# Altium schematic sheet USBStereoAudioCodec.SchDoc
size A
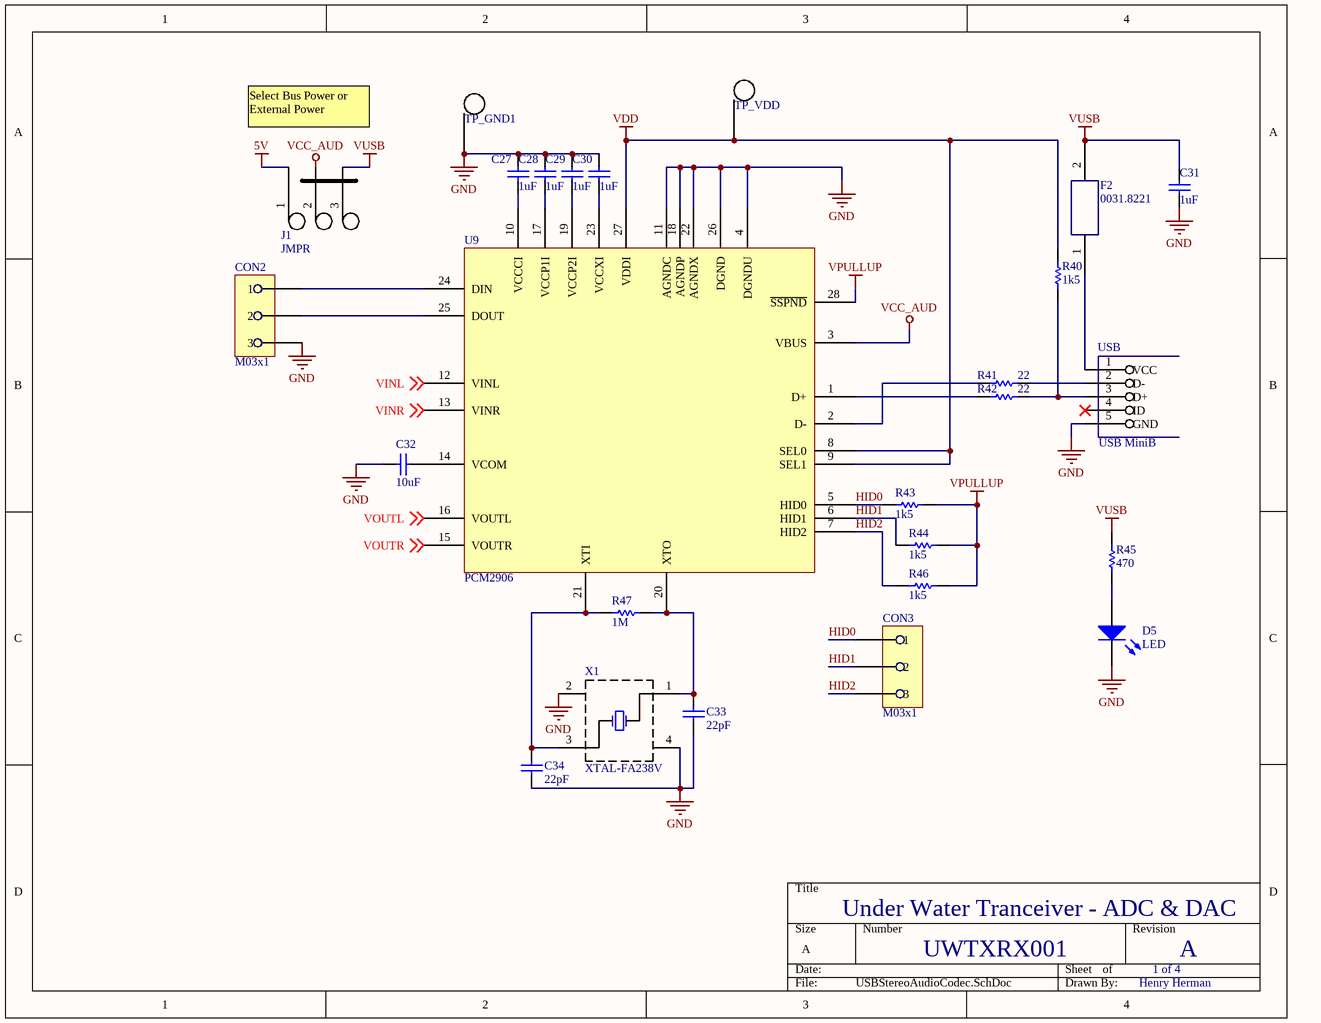
[diagram p0: USBStereoAudioCodec.SchDoc]

## Parts
C27  value 1uF  [SM/C_0805]  (hidden comment: CAP)
C28  value 1uF  [SM/C_0805]  (hidden comment: CAP)
C29  value 1uF  [SM/C_0805]  (hidden comment: CAP)
C30  value 1uF  [SM/C_0805]  (hidden comment: CAP)
C31  value 1uF  [SM/C_0805]  (hidden comment: CAP)
C32  value 10uF  [SM/C_0805]  (hidden comment: CAP)
C33  value 22pF  [SM/C_0805]  (hidden comment: CAP)
C34  value 22pF  [SM/C_0805]  (hidden comment: CAP)
CON2  M03x1  [M03x1]
CON3  M03x1  [M03x1]
D5  LED  [LED-0805]
F2  0031.8221  [SM/R_0805]
J1  JMPR  [M03x1-nolock]
R40  value 1k5  [SM/R_0805]  (hidden comment: Res)
R41  value 22  [SM/R_0805]  (hidden comment: Res)
R42  value 22  [SM/R_0805]  (hidden comment: Res)
R43  value 1k5  [SM/R_0805]  (hidden comment: Res)
R44  value 1k5  [SM/R_0805]  (hidden comment: Res)
R45  value 470  [SM/R_0805]  (hidden comment: Res)
R46  value 1k5  [SM/R_0805]  (hidden comment: Res)
R47  value 1M  [SM/R_0805]  (hidden comment: Res)
TP_GND1  TEST_PT  [TEST_PT_SMD]  (value not drawn)
TP_VDD  TEST_PT  [TEST_PT_SMD]  (value not drawn)
U9  PCM2906  [SSOP-28PIN-TI]
USB  USB MiniB  [USB-MINIB]
X1  XTAL-FA238V  [XTAL 12MHz SMD]

## Nets
5V: J1.1(P1)
GND: C27.1 C28.1 C29.1 C30.1 C31.2 C32.2 C33.1 C34.1 CON2.3 D5.2(K) TP_GND1.1(TP?) U9.4(DGNDU) U9.11(AGNDC) U9.18(AGNDP) U9.22(AGNDX) U9.26(DGND) USB.5(GND) X1.2 X1.4
VCC_AUD: J1.2(P2) U9.3(VBUS)
VDD: R40.1 TP_VDD.1(TP?) U9.8(SEL0) U9.9(SEL1) U9.27(VDDI)
VPULLUP: R43.2 R44.2 R46.2 U9.28(~{SSPND})
VUSB: C31.1 F2.2 J1.3 R45.1
HID0: CON3.1 R43.1 U9.5(HID0)
HID1: CON3.2 R44.1 U9.6(HID1)
HID2: CON3.3 R46.1 U9.7(HID2)
VINL: U9.12(VINL) ; off-sheet VINL
VINR: U9.13(VINR) ; off-sheet VINR
VOUTL: U9.16(VOUTL) ; off-sheet VOUTL
VOUTR: U9.15(VOUTR) ; off-sheet VOUTR
NetC27_2: C27.2 U9.10(VCCCI)
NetC28_2: C28.2 U9.17(VCCP1I)
NetC29_2: C29.2 U9.19(VCCP2I)
NetC30_2: C30.2 U9.23(VCCXI)
NetC32_1: C32.1 U9.14(VCOM)
NetC33_2: C33.2 R47.1 U9.20(XTO) X1.1
NetC34_2: C34.2 R47.2 U9.21(XTI) X1.3
NetCON2_1: CON2.1 U9.24(DIN)
NetCON2_2: CON2.2 U9.25(DOUT)
NetD5_1: D5.1(A) R45.2
NetF2_1: F2.1 USB.1(VCC)
NetR40_2: R40.2 R42.2 USB.3(D+)
NetR41_1: R41.1 U9.2(D-)
NetR41_2: R41.2 USB.2(D-)
NetR42_1: R42.1 U9.1(D+)

Not connected (* = marked no-connect by the designer): USB 4(ID)*

## Notes on the sheet
- Select Bus Power or External Power
- Under Water Tranceiver - ADC & DAC
- UWTXRX001
- 1 of 4
- A
- Henry Herman

## Library data of the parts
F2 = Ferrite Bead: Published: 8-Jun-2000; LatestRevisionDate: 17-Jan-2003; LatestRevisionNote: PCB Footprint 'BCY-W3/D4.7' replaced; DatasheetDocument: 1997; PackageDocument: Sep-1998; PackageReference: TO-92A; Publisher: Altium Limited; ComponentLink1Description: Manufacturer Link; ComponentLink1URL: http://www.fairchildsemi.com/; ComponentLink2Description: Datasheet; ComponentLink2URL: http://www.fairchildsemi.com/ds/2N%2F2N3904.pdf
J1 = JMPR-3: Jumper; Published: 8-Jun-2000; LatestRevisionDate: 17-Jan-2003; LatestRevisionNote: PCB Footprint 'BCY-W3/D4.7' replaced; DatasheetDocument: 1997; PackageDocument: Sep-1998; PackageReference: TO-92A; Publisher: Altium Limited; ComponentLink1Description: Manufacturer Link; ComponentLink1URL: http://www.fairchildsemi.com/; ComponentLink2Description: Datasheet; ComponentLink2URL: http://www.fairchildsemi.com/ds/2N%2F2N3904.pdf
R40-R47 = Res: Resistor; Published: 8-Jun-2000; LatestRevisionDate: 17-Jul-2002; LatestRevisionNote: Re-released for DXP Platform.; PackageReference: AXIAL-0.3; Publisher: Altium Limited
U9 = PCM2906C
USB = USB MiniB: NPN General Purpose Amplifier; Published: 8-Jun-2000; LatestRevisionDate: 17-Jan-2003; LatestRevisionNote: PCB Footprint 'BCY-W3/D4.7' replaced; DatasheetDocument: 1997; PackageDocument: Sep-1998; PackageReference: TO-92A; Publisher: Altium Limited; ComponentLink1Description: Manufacturer Link; ComponentLink1URL: http://www.fairchildsemi.com/; ComponentLink2Description: Datasheet; ComponentLink2URL: http://www.fairchildsemi.com/ds/2N%2F2N3904.pdf
C27-C34 = CAP
  C27-C31: Label: 1uF
  C32: Label: 10uF